# Altium schematic sheet EN-C200_RA0_OLED_只有元器件.SchDoc
size A4
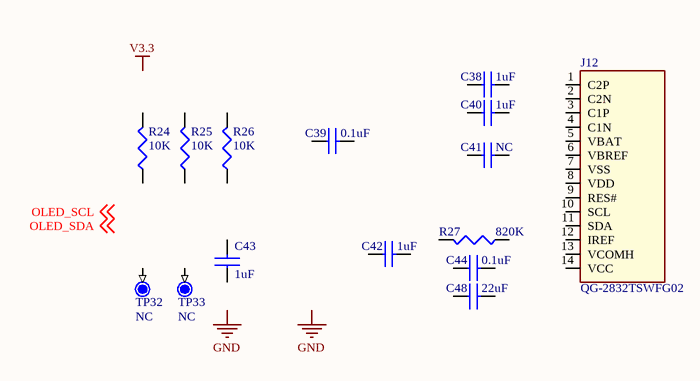
[diagram p0: EN-C200_RA0_OLED_只有元器件.SchDoc]

## Parts
C38  1uF  [SC0603]
C39  0.1uF  [SC0603]
C40  1uF  [SC0603]
C41  NC  [SC0603]
C42  1uF  [SC0603]
C43  1uF  [SC0603]
C44  0.1uF  [SC0603]
C48  22uF  [SC0805]
J12  QG-2832TSWFG02  [FPC14-25]
R24  10K  [SR0603]
R25  10K  [SR0603]
R26  10K  [SR0603]
R27  820K  [SR0603]
TP32  NC  [TP32-SMD]
TP33  NC  [TP32-SMD]

## Nets

Not connected (* = marked no-connect by the designer): C38 1 2; C39 1 2; C40 1 2; C41 1 2; C42 1 2; C43 1 2; C44 1 2; C48 1 2; J12 1(C2P) 2(C2N) 3(C1P) 4(C1N) 5(VBAT) 6(VBREF) 7(VSS) 8(VDD) 9(RES#) 10(SCL) 11(SDA) 12(IREF) 13(VCOMH) 14(VCC); R24 1 2; R25 1 2; R26 1 2; R27 1 2; TP32 1; TP33 1

## Notes on the sheet
- Labels drawn without touching a wire or pin: GND, OLED_SCL, OLED_SDA, V3.3

## Library data of the parts
C38-C44 C48 = CAP NP
J12 = OLED_0.91
R24-R27 = RESISTOR
TP32 TP33 = TP